# Altium schematic sheet Top.SchDoc: Top level
size A4; Author: Bram Bremer; CompanyName: Green Team Twente; Organization: Green Team Twente; Revision: V1.1; SheetNumber: 1; SheetTotal: 10; Team: 2024; Subsystem: Embedded Systems
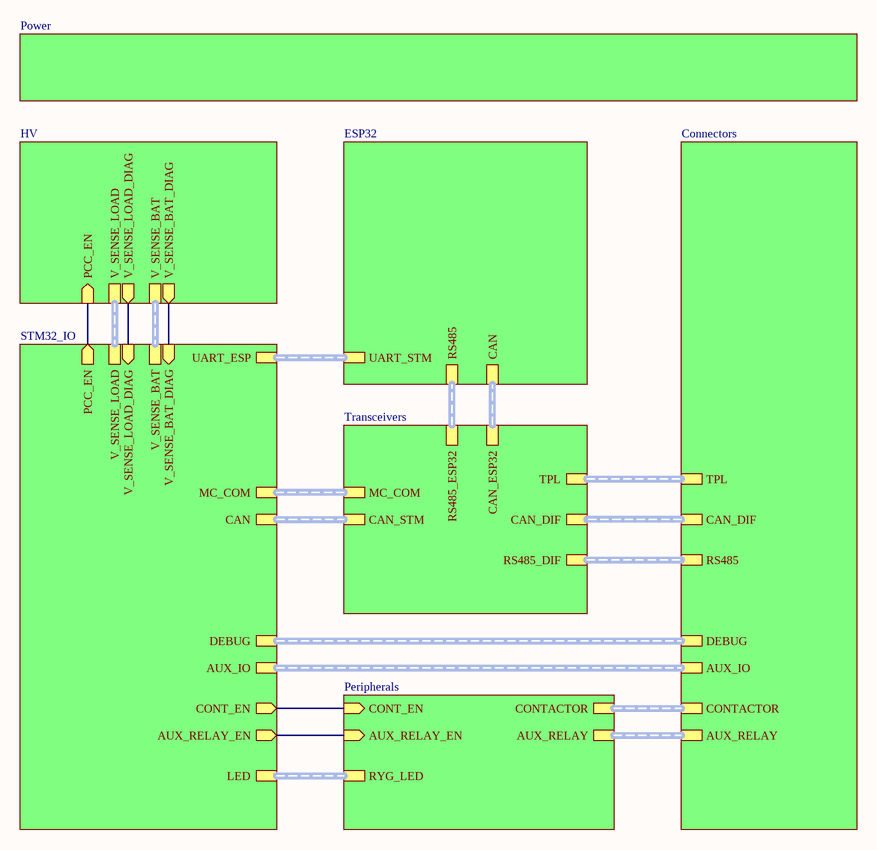
[diagram p0: Top.SchDoc]

## Sub-sheets
Connectors = Connectors: CAN_DIF (harness CAN_DIF), TPL (harness TPL), CONTACTOR (harness CONTACTOR), DEBUG (harness STDC14), RS485 (harness RS485_DIF), AUX_RELAY (harness AUX_RELAY), AUX_IO (harness AUX_IO)
Designator = HV: PCC_EN (in), V_SENSE_LOAD, V_SENSE_BAT, V_SENSE_LOAD_DIAG (out), V_SENSE_BAT_DIAG (out)
ESP32 = ESP32: RS485 (harness RS485), CAN (harness CAN), UART_STM (harness UART)
Peripherals = Peripherals: CONT_EN (in), RYG_LED (harness RGB_LED), CONTACTOR (harness CONTACTOR), AUX_RELAY_EN (in), AUX_RELAY (harness AUX_RELAY)
Power = Power: no entries
STM32 = STM32_IO: DEBUG (harness STDC14), MC_COM (harness MC_COM), CAN (harness CAN), LED (harness RYG_LED), AUX_RELAY_EN (out), CONT_EN (out), V_SENSE_LOAD (harness ANA_DIF), V_SENSE_BAT (harness ANA_DIF), PCC_EN (out), V_SENSE_LOAD_DIAG (in), V_SENSE_BAT_DIAG (in), AUX_IO (harness AUX_IO), UART_ESP (harness UART)
Transceivers = Transceivers: CAN_STM (harness CAN), MC_COM (harness MC_COM), CAN_DIF (harness CAN_DIF), TPL (harness TPL), CAN_ESP32 (harness CAN), RS485_DIF (harness RS485_DIF), RS485_ESP32 (harness RS485)

## Nets
(unnamed): sheet STM32/AUX_RELAY_EN, sheet Peripherals/AUX_RELAY_EN
(unnamed): sheet STM32/CONT_EN, sheet Peripherals/CONT_EN
(unnamed): sheet STM32/PCC_EN, sheet Designator/PCC_EN
(unnamed): sheet STM32/V_SENSE_LOAD_DIAG, sheet Designator/V_SENSE_LOAD_DIAG
(unnamed): sheet STM32/V_SENSE_BAT_DIAG, sheet Designator/V_SENSE_BAT_DIAG

## Buses and harness runs
harness sheet Connectors/AUX_IO = sheet STM32/AUX_IO
harness sheet Connectors/AUX_RELAY = sheet Peripherals/AUX_RELAY
harness sheet Connectors/CAN_DIF = sheet Transceivers/CAN_DIF
harness sheet Connectors/CONTACTOR = sheet Peripherals/CONTACTOR
harness sheet Connectors/DEBUG = sheet STM32/DEBUG
harness sheet Connectors/RS485 = sheet Transceivers/RS485_DIF
harness sheet Connectors/TPL = sheet Transceivers/TPL
harness sheet Designator/V_SENSE_BAT = sheet STM32/V_SENSE_BAT
harness sheet Designator/V_SENSE_LOAD = sheet STM32/V_SENSE_LOAD
harness sheet ESP32/CAN = sheet Transceivers/CAN_ESP32
harness sheet ESP32/RS485 = sheet Transceivers/RS485_ESP32
harness sheet ESP32/UART_STM = sheet STM32/UART_ESP
harness sheet Peripherals/RYG_LED = sheet STM32/LED
harness sheet STM32/CAN = sheet Transceivers/CAN_STM
harness sheet STM32/MC_COM = sheet Transceivers/MC_COM

## Notes on the sheet
- Team
- Authors
- Revision
- Title
- Project
- Subsystem
- File
- Sheet
- //